# Altium schematic sheet BPDC mid.SchDoc
size A
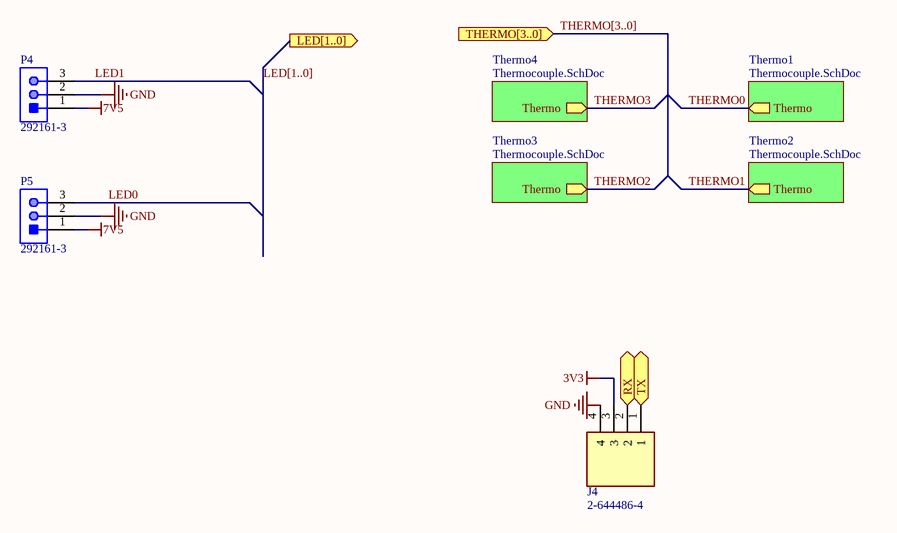
[diagram p0: BPDC mid.SchDoc]

## Parts
J4  2-644486-4  [26444864]
P4  292161-3  [TECO-292161-3_V]
P5  292161-3  [TECO-292161-3_V]

## Sub-sheets
Thermo1 = Thermocouple.SchDoc: Thermo (out)
Thermo2 = Thermocouple.SchDoc: Thermo (out)
Thermo3 = Thermocouple.SchDoc: Thermo (out)
Thermo4 = Thermocouple.SchDoc: Thermo (out)

## Ports
LED[1..0] (out), RX (bidir), THERMO[3..0] (in), TX (bidir)

## Nets
3V3: J4.3
7V5: P4.1 P5.1
GND: J4.4 P4.2 P5.2
LED0: P5.3
LED1: P4.3
RX: J4.2 ; port RX
THERMO0: sheet Thermo1/Thermo
THERMO1: sheet Thermo2/Thermo
THERMO2: sheet Thermo3/Thermo
THERMO3: sheet Thermo4/Thermo
TX: J4.1 ; port TX

## Buses and harness runs
bus LED[1..0] = port LED[1..0]
bus THERMO[3..0] = port THERMO[3..0]

## Library data of the parts
J4 = 2-644486-4: Connector; Manufacturer_Name: TE Connectivity; Datasheet Link: http://www.te.com/commerce/DocumentDelivery/DDEController?Action=showdoc&DocId=Customer+Drawing%7F644486%7FL%7Fpdf%7FEnglish%7FENG_CD_644486_L_baseFilename.pdf%7F2-644486-4.pdf; Height: 10.668mm; Manufacturer_Part_Number: 2-644486-4; Mouser Part Number: 571-2-644486-4; Mouser Price/Stock: https://www.mouser.co.uk/ProductDetail/TE-Connectivity-AMP/2-644486-4?qs=8XyASyDp%2FcDn2y5ith8QSA%3D%3D; Arrow Part Number: 2-644486-4; Arrow Price/Stock: https://www.arrow.com/en/products/2-644486-4/te-connectivity
P4 P5 = CMP-2000-05551-1: Male Header, Pitch 2 mm, 1 x 3 Position, Height 6.8 mm, Tail Length 3.2 mm, -40 to 105 degC, RoHS, Bulk; Manufacturer: TE Connectivity; SVHC: NoSVHC(15-Jun-2015); Pitch Spacing: 2mm; Contact Termination Type: ThroughHole; No. of Rows: 1Rows; No. of Contacts: 3Contacts; Product Range: AMPCTSeries; Mounting Technology: ThroughHole; Manufacturer URL: http://www.te.com/; Contact Material: Brass; Datasheet URL: http://www.te.com/commerce/DocumentDelivery/DDEController?Action=showdoc&DocId=Customer+Drawing%7F292161%7FP1%7Fpdf%7FEnglish%7FENG_CD_292161_P1.pdf%7F292161-3; Package Reference: 292161-3; Contact Plating: TinPlatedContacts; Gender: Header; Datasheet Version: Rev. P1, 06/2016; Package Description: Male Header, Pitch 2 mm, 1 x 3 Position, Height 6.8 mm, Tail Length 3.2 mm